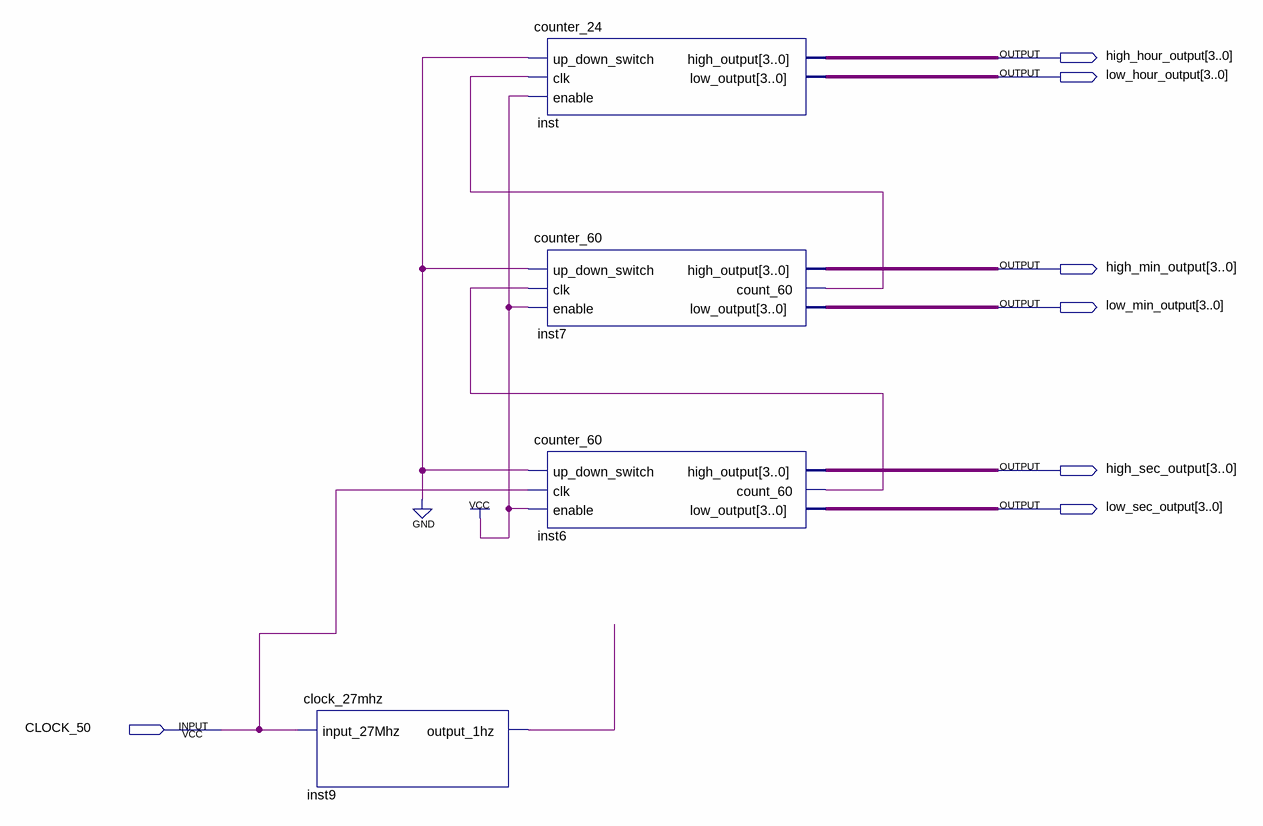
[diagram p0: schematic sheet]
// Quartus schematic ez_counter.bdf as structural Verilog: 4 symbols, 7 pins
module ez_counter (
  input  CLOCK_50,
  output [3:0] high_hour_output,
  output [3:0] low_hour_output,
  output [3:0] high_min_output,
  output [3:0] low_min_output,
  output [3:0] high_sec_output,
  output [3:0] low_sec_output
);

  wire inst6_count_60, inst7_count_60, inst9_output_1hz;

  clock_27mhz inst9 (.input_27Mhz(CLOCK_50), .output_1hz(inst9_output_1hz));
  counter_24 inst (
    .up_down_switch(1'b0), .clk(inst7_count_60), .enable(1'b1), .high_output(high_hour_output),
    .low_output(low_hour_output));
  counter_60 inst7 (
    .up_down_switch(1'b0), .clk(inst6_count_60), .enable(1'b1), .high_output(high_min_output),
    .count_60(inst7_count_60), .low_output(low_min_output));
  counter_60 inst6 (
    .up_down_switch(1'b0), .clk(CLOCK_50), .enable(1'b1), .high_output(high_sec_output),
    .count_60(inst6_count_60), .low_output(low_sec_output));
endmodule
